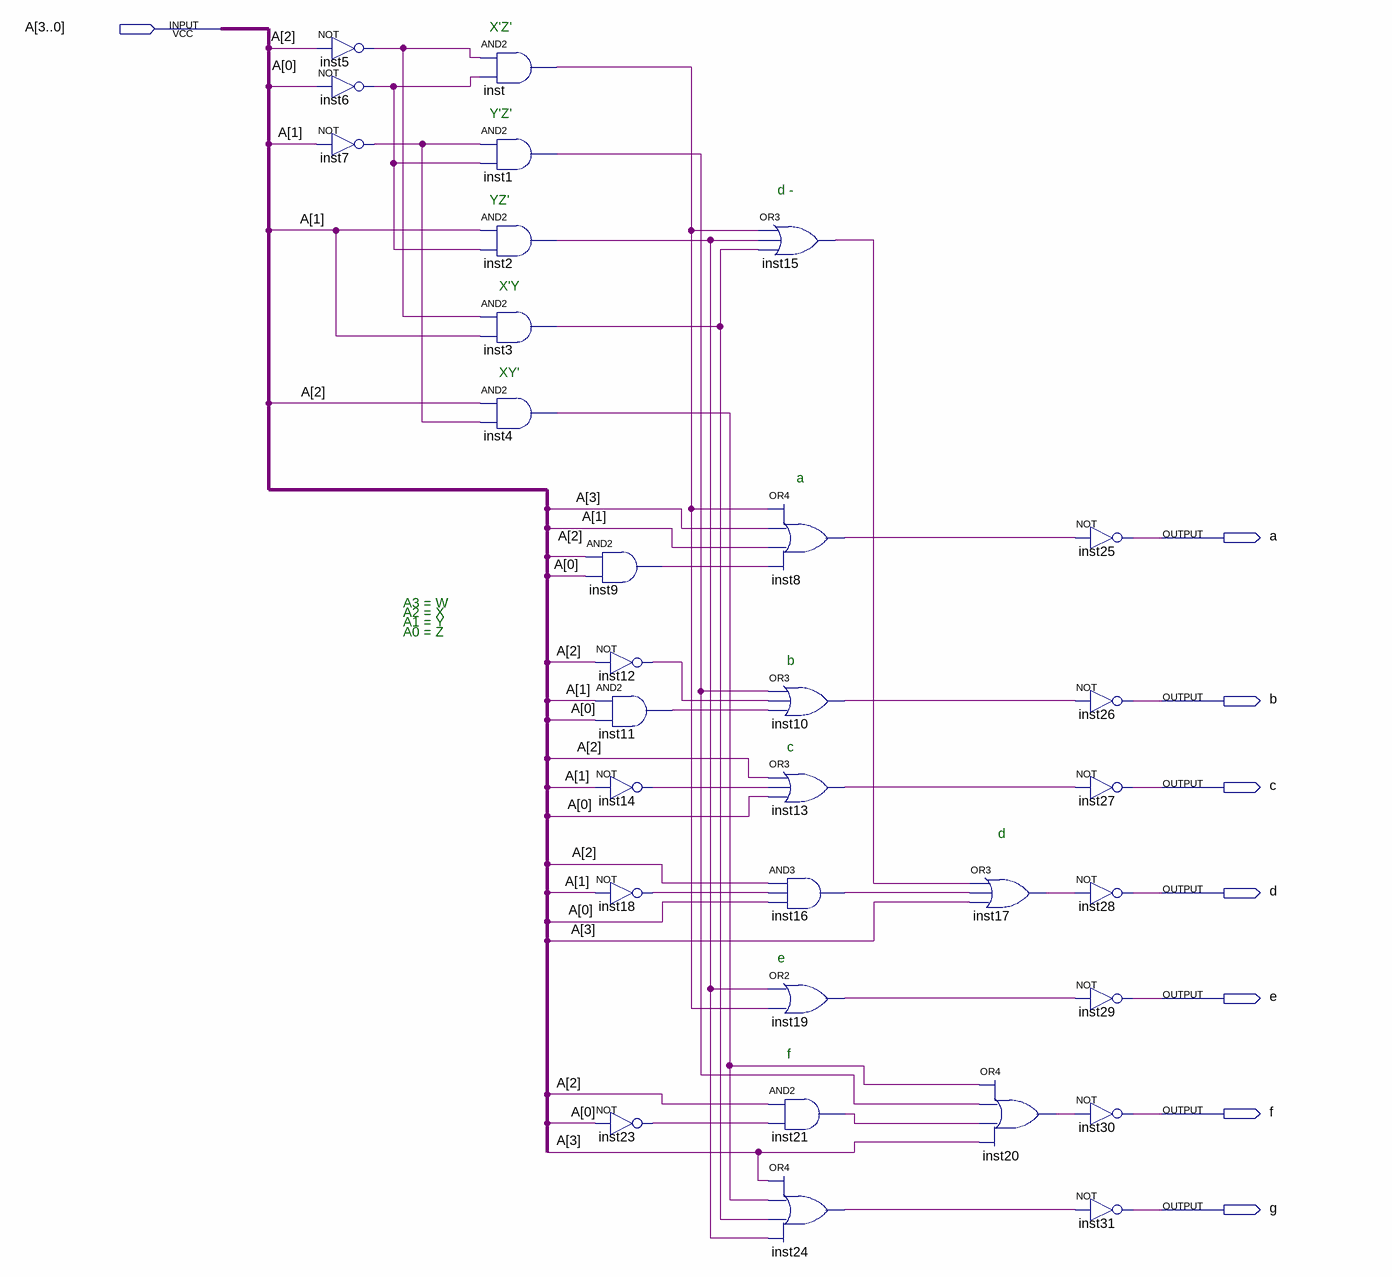
[diagram p0: schematic sheet]
// Quartus schematic lab6_p2.bdf as structural Verilog: 31 symbols, 8 pins
module lab6_p2 (
  input  [3:0] A,
  output A_1bit,
  output b,
  output c,
  output d,
  output e,
  output f,
  output g
);

  wire inst1_out, inst2_out, inst3_out, inst4_out, inst5_out, inst6_out, inst7_out, inst8_out, inst9_out,
       inst10_out, inst11_out, inst12_out, inst13_out, inst14_out, inst15_out, inst16_out, inst17_out,
       inst18_out, inst19_out, inst20_out, inst21_out, inst23_out, inst24_out, inst_out;

  not inst5 (inst5_out, A[2]);
  not inst6 (inst6_out, A[0]);
  not inst7 (inst7_out, A[1]);
  and inst (inst_out, inst5_out, inst6_out);
  and inst1 (inst1_out, inst7_out, inst6_out);
  and inst2 (inst2_out, A[1], inst6_out);
  and inst3 (inst3_out, inst5_out, A[1]);
  and inst4 (inst4_out, A[2], inst7_out);
  and inst9 (inst9_out, A[2], A[0]);
  not inst12 (inst12_out, A[2]);
  and inst11 (inst11_out, A[1], A[0]);
  not inst14 (inst14_out, A[1]);
  not inst18 (inst18_out, A[1]);
  not inst23 (inst23_out, A[0]);
  or inst15 (inst15_out, inst_out, inst2_out, inst3_out);
  or inst8 (inst8_out, inst_out, A[3], A[1], inst9_out);
  or inst10 (inst10_out, inst1_out, inst12_out, inst11_out);
  or inst13 (inst13_out, A[2], inst14_out, A[0]);
  and inst16 (inst16_out, A[2], inst18_out, A[0]);
  or inst19 (inst19_out, inst2_out, inst_out);
  and inst21 (inst21_out, A[2], inst23_out);
  or inst24 (inst24_out, A[3], inst4_out, inst3_out, inst2_out);
  or inst17 (inst17_out, inst15_out, inst16_out, A[3]);
  or inst20 (inst20_out, inst4_out, inst1_out, inst21_out, A[3]);
  not inst25 (A_1bit, inst8_out);
  not inst26 (b, inst10_out);
  not inst27 (c, inst13_out);
  not inst28 (d, inst17_out);
  not inst29 (e, inst19_out);
  not inst30 (f, inst20_out);
  not inst31 (g, inst24_out);

  // Notes on the sheet:
  //   X'Z'
  //   Y'Z'
  //   d - 
  //   YZ'
  //   X'Y
  //   XY'
  //   a
  //   A3 = W
  //   A2 = X
  //   A1 = Y
  //   A0 = Z
  //   b
  //   c
  //   d
  //   e
  //   f
endmodule
